# Altium project mainpcb.PrjPcb (part 1 of 2)
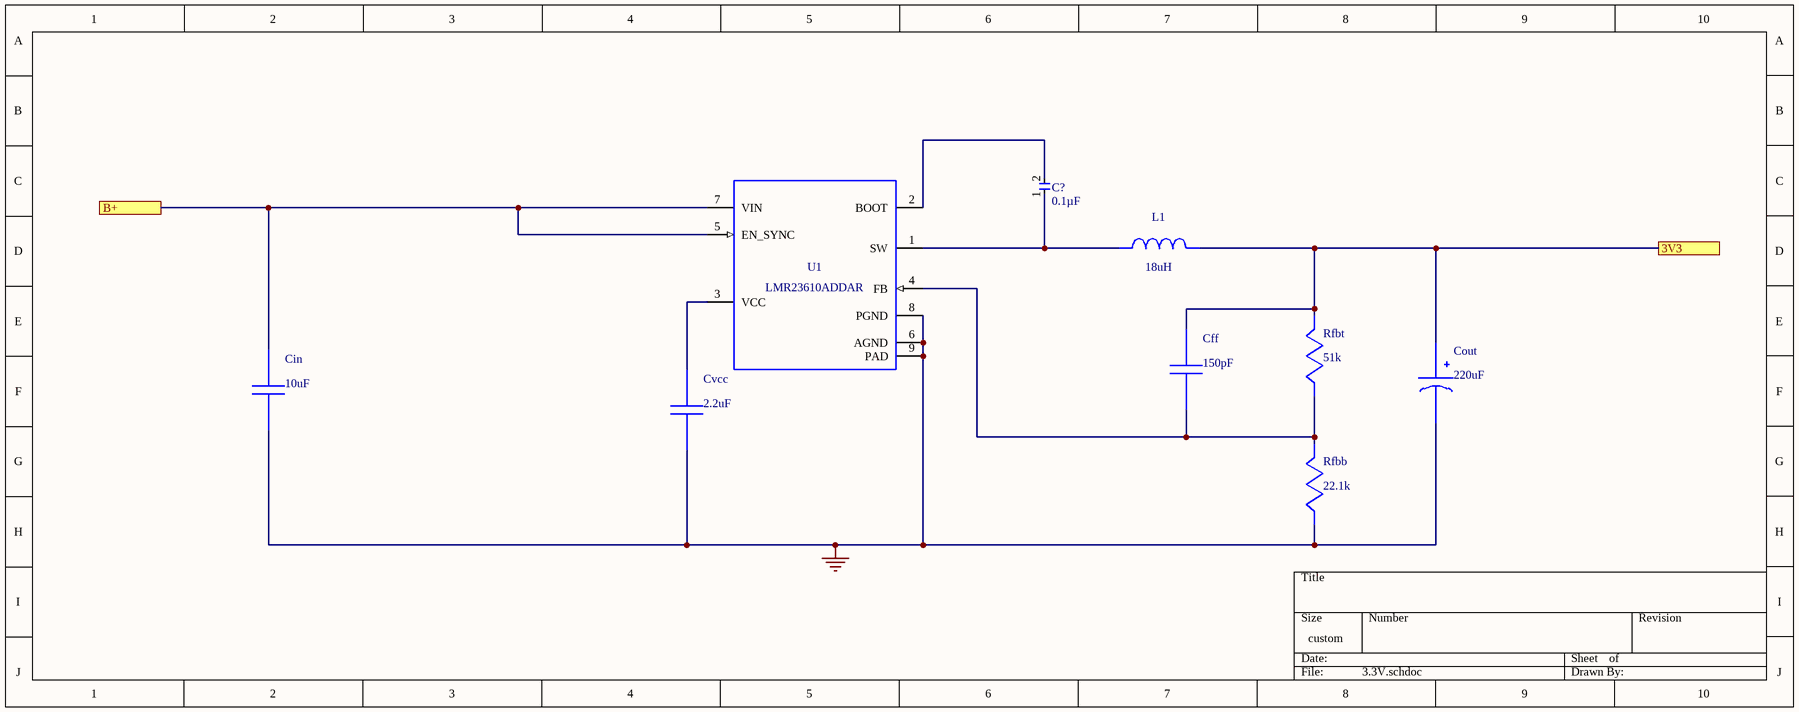
[diagram p0: 3.3V.schdoc]
5 sheets, 73 parts. Net scope: flat (ports and power ports of the same name join across sheets).
Sheets:
  3.3V.schdoc
  7.4V.schdoc
  BMS.SchDoc
  mainpcb.SchDoc
  Power sTM.SchDoc

## Sheet 3.3V.schdoc
size 336 x 132 mm; SheetNumber: 1; SheetTotal: 5

### Parts
(Parts that share a designator on the sheet are numbered #1, #2 ... from top to bottom, then left to right.)
C?#1  0.1µF
Cff  value 150pF  (hidden comment: 250R07N151JV4T)
Cin#1  value 10uF  (hidden comment: C3225X7R1H106M250AC)
Cout#1  value 220uF  (hidden comment: 6SVPE220MW)
Cvcc  value 2.2uF  (hidden comment: C0603C225K8PACTU)
L1#1  value 18uH  (hidden comment: NPI54C180MTRF)
Rfbb#1  value 22.1k  (hidden comment: CRCW040222K1FKED)
Rfbt#1  value 51k  (hidden comment: RC0603FR-0751KL)
U1#1  LMR23610ADDAR

### Ports
3V3, B+

### Nets
0: Cin#1.2 Cout#1.2(-) Cvcc.2 Rfbb#1.2 U1#1.6(AGND) U1#1.8(PGND) U1#1.9(PAD)
NetC?#1_1: C?#1.1 L1#1.1 U1#1.1(SW)
NetC?#1_2: C?#1.2 U1#1.2(BOOT)
NetCff_1: Cff.1 Cout#1.1(+) L1#1.2 Rfbt#1.1 ; port 3V3
NetCff_2: Cff.2 Rfbb#1.1 Rfbt#1.2 U1#1.4(FB)
NetCin#1_1: Cin#1.1 U1#1.5(EN_SYNC) U1#1.7(VIN) ; port B+
NetCvcc_1: Cvcc.1 U1#1.3(VCC)

### Library data of the parts
C?#1 = C0805C104K5RACTU: Cap Ceramic 0.1uF 50V X7R 10% SMD 2.0 x 1.2 mm 125 C Paper T/R; Manufacturer: KEMET; Capacitance: 100nF; Voltage: 500V; Supplier 1: Farnell; Manufacturer Part Number: C0805C104K5RACTU; RoHS: Yes; Category: Ceramic Capacitors; Stock 1: 148517; Pricing 1: 10=0,07810, 100=0,05810, 500=0,03910, 1000=0,03450, 2000=0,03090 (GBP); Mount: Surface Mount,PCB; Case/Package: 0805; Number of Pins: 2; Case Code (Imperial): 0805; Case Code (Metric): 2012; Contact Plating: Tin,Matte; Dielectric Material: Ceramic; Min Operating Temperature: -55°C; Max Operating Temperature: 125°C; Tolerance: 10%; Dielectric: X7R; Package Quantity: 4000; Voltage Rating: 50V; Packaging: Tape and Reel; Voltage Rating (DC): 50V; Termination: SMD/SMT; Series: C0805C; Construction: Flat; Length: 2mm; Width: 1.2mm; Height: 0.9mm; Depth: 1.25mm; Lead Pitch: 0.75mm; Thickness: 0.035inch; Radiation Hardening: No; RoHS Compliant: Yes; REACH SVHC: No SVHC; ComponentLink1URL: https://datasheet.ciiva.com/14589/70095383-14589048.pdf?src-supplier=Allied+Electronics; ComponentLink1Description: https://datasheet.ciiva.com/14589/70095383-14589048.pdf?src-supplier=Allied+Electronics; ComponentLink2URL: https://datasheet.ciiva.com/28682/1851736-28682232.pdf?src-supplier=Element14; ComponentLink2Description: https://datasheet.ciiva.com/28682/1851736-28682232.pdf?src-supplier=Element14; ComponentLink3URL: https://datasheet.ciiva.com/32431/slceramic-chip-condensers-e-32431755.pdf?src-supplier=Distrelec; ComponentLink3Description: https://datasheet.ciiva.com/32431/slceramic-chip-condensers-e-32431755.pdf?src-supplier=Distrelec; ComponentLink4URL: https://datasheet.ciiva.com/18410/70095383-18410815.pdf?src-supplier=Allied+Electronics; ComponentLink4Description: https://datasheet.ciiva.com/18410/70095383-18410815.pdf?src-supplier=Allied+Electronics; Supplier Part Number 1: 1414664
Cff = 250R07N151JV4T: Manufacturer Name: Johanson Technology; PackageReference: 250R07N151JV4T; Manufacturer Part Number: 250R07N151JV4T
Cin#1 = C3225X7R1H106M250AC: C3225X7R1H106M25; Manufacturer Name: TDK; PackageReference: C3225X7R1H106M250AC; Manufacturer Part Number: C3225X7R1H106M250AC
Cout#1 = 6SVPE220MW: Manufacturer Name: Panasonic; PackageReference: 6SVPE220MW; Manufacturer Part Number: 6SVPE220MW
Cvcc = C0603C225K8PACTU: Manufacturer Name: Kemet; PackageReference: C0603C225K8PACTU; Manufacturer Part Number: C0603C225K8PACTU
L1#1 = NPI54C180MTRF: Manufacturer Name: NIC Components; PackageReference: NPI54C180MTRF; Manufacturer Part Number: NPI54C180MTRF
Rfbb#1 = CRCW040222K1FKED: Manufacturer Name: Vishay-Dale; PackageReference: CRCW040222K1FKED; Manufacturer Part Number: CRCW040222K1FKED
Rfbt#1 = RC0603FR-0751KL: Manufacturer Name: Yageo; PackageReference: RC0603FR-0751KL; Manufacturer Part Number: RC0603FR-0751KL
U1#1 = LMR23610ADDAR: Manufacturer Name: Texas Instruments; PackageReference: LMR23610ADDAR; Manufacturer Part Number: LMR23610ADDAR; Value: N/A

## Sheet 7.4V.schdoc
size 349 x 134 mm; SheetNumber: 2; SheetTotal: 5
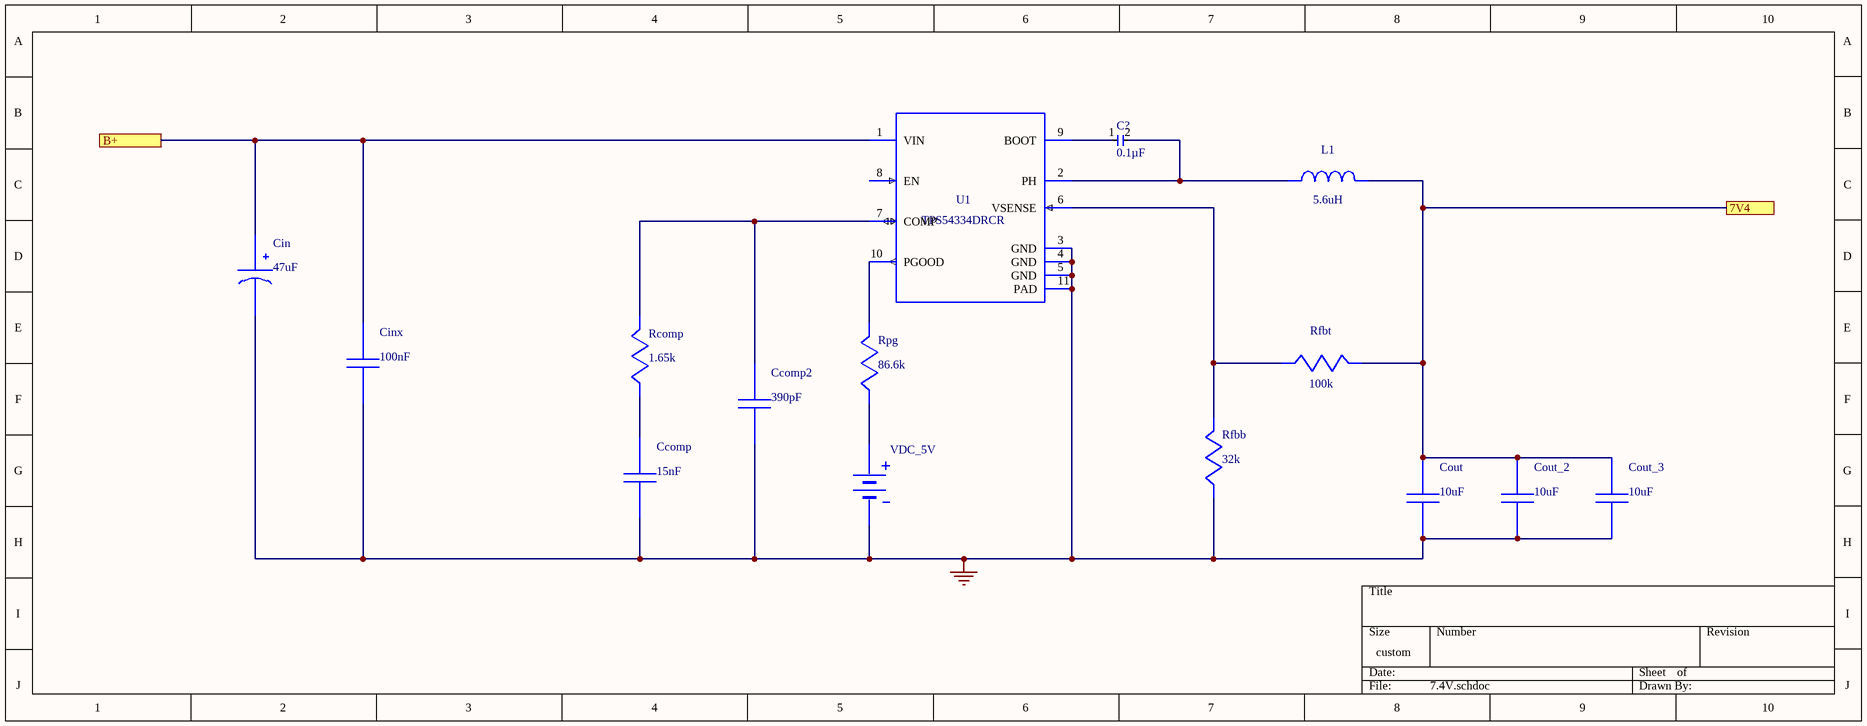
[diagram p1: 7.4V.schdoc]

### Parts
(Parts that share a designator on the sheet are numbered #1, #2 ... from top to bottom, then left to right.)
C?#2  0.1µF
Ccomp  value 15nF  (hidden comment: CGA4F2C0G1H153J085AA)
Ccomp2  value 390pF  (hidden comment: GRM1555C1H391JA01J)
Cin#2  value 47uF  (hidden comment: EEE-FC1H470P)
Cinx  value 100nF  (hidden comment: C0805C104M5RACTU)
Cout#2  value 10uF  (hidden comment: C0805C106K8PACTU)
Cout_2  value 10uF  (hidden comment: C0805C106K8PACTU)
Cout_3  value 10uF  (hidden comment: C0805C106K8PACTU)
L1#2  value 5.6uH  (hidden comment: NPI54C5R6MTRF)
Rcomp  value 1.65k  (hidden comment: CRCW04021K65FKED)
Rfbb#2  value 32k  (hidden comment: TNPW040232K0BEED)
Rfbt#2  value 100k  (hidden comment: CRCW0402100KFKED)
Rpg  value 86.6k  (hidden comment: RC0201FR-0786K6L)
U1#2  TPS54334DRCR
VDC_5V  WB_PRIM_DC_VOLTAGE_SOURCE  (value not drawn)

### Ports
7V4, B+

### Nets
0: Ccomp.2 Ccomp2.2 Cin#2.2(-) Cinx.2 Cout#2.2 Cout_2.2 Cout_3.2 Rfbb#2.1 U1#2.3(GND) U1#2.4(GND) U1#2.5(GND) U1#2.11(PAD) VDC_5V.2(-)
NetC?#2_1: C?#2.1 U1#2.9(BOOT)
NetC?#2_2: C?#2.2 L1#2.1 U1#2.2(PH)
NetCcomp2_1: Ccomp2.1 Rcomp.1 U1#2.7(COMP)
NetCcomp_1: Ccomp.1 Rcomp.2
NetCin#1_1: Cin#2.1(+) Cinx.1 U1#2.1(VIN) ; port B+
NetCout#2_1: Cout#2.1 Cout_2.1 Cout_3.1 L1#2.2 Rfbt#2.1 ; port 7V4
NetRfbb#2_2: Rfbb#2.2 Rfbt#2.2 U1#2.6(VSENSE)
NetRpg_1: Rpg.1 U1#2.10(PGOOD)
NetRpg_2: Rpg.2 VDC_5V.1(+)

Not connected (* = marked no-connect by the designer): U1#2 8(EN)

### Library data of the parts
C?#2 = C0805C104K5RACTU: as C?#1 on sheet 3.3V; Supplier 1: Farnell; Manufacturer Part Number: C0805C104K5RACTU; RoHS: Yes; Category: Ceramic Capacitors; Stock 1: 148517; Pricing 1: 10=0,07810, 100=0,05810, 500=0,03910, 1000=0,03450, 2000=0,03090 (GBP); Mount: Surface Mount,PCB; Case/Package: 0805; Number of Pins: 2; Case Code (Imperial): 0805; Case Code (Metric): 2012; Contact Plating: Tin,Matte; Dielectric Material: Ceramic; Min Operating Temperature: -55°C; Max Operating Temperature: 125°C; Tolerance: 10%; Dielectric: X7R; Package Quantity: 4000; Voltage Rating: 50V; Packaging: Tape and Reel; Voltage Rating (DC): 50V; Termination: SMD/SMT; Series: C0805C; Construction: Flat; Length: 2mm; Width: 1.2mm; Height: 0.9mm; Depth: 1.25mm; Lead Pitch: 0.75mm; Thickness: 0.035inch; Radiation Hardening: No; RoHS Compliant: Yes; REACH SVHC: No SVHC; ComponentLink1URL: https://datasheet.ciiva.com/14589/70095383-14589048.pdf?src-supplier=Allied+Electronics; ComponentLink1Description: https://datasheet.ciiva.com/14589/70095383-14589048.pdf?src-supplier=Allied+Electronics; ComponentLink2URL: https://datasheet.ciiva.com/28682/1851736-28682232.pdf?src-supplier=Element14; ComponentLink2Description: https://datasheet.ciiva.com/28682/1851736-28682232.pdf?src-supplier=Element14; ComponentLink3URL: https://datasheet.ciiva.com/32431/slceramic-chip-condensers-e-32431755.pdf?src-supplier=Distrelec; ComponentLink3Description: https://datasheet.ciiva.com/32431/slceramic-chip-condensers-e-32431755.pdf?src-supplier=Distrelec; ComponentLink4URL: https://datasheet.ciiva.com/18410/70095383-18410815.pdf?src-supplier=Allied+Electronics; ComponentLink4Description: https://datasheet.ciiva.com/18410/70095383-18410815.pdf?src-supplier=Allied+Electronics; Supplier Part Number 1: 1414664
Ccomp = CGA4F2C0G1H153J085AA: CGA4F2C0G1H153J0; Manufacturer Name: TDK; PackageReference: CGA4F2C0G1H153J085AA; Manufacturer Part Number: CGA4F2C0G1H153J085AA
Ccomp2 = GRM1555C1H391JA01J: GRM1555C1H391JA0; Manufacturer Name: MuRata; PackageReference: GRM1555C1H391JA01J; Manufacturer Part Number: GRM1555C1H391JA01J
Cin#2 = EEE-FC1H470P: Manufacturer Name: Panasonic; PackageReference: EEE-FC1H470P; Manufacturer Part Number: EEE-FC1H470P
Cinx = C0805C104M5RACTU: Manufacturer Name: Kemet; PackageReference: C0805C104M5RACTU; Manufacturer Part Number: C0805C104M5RACTU
Cout#2 Cout_2 Cout_3 = C0805C106K8PACTU: Manufacturer Name: Kemet; PackageReference: C0805C106K8PACTU; Manufacturer Part Number: C0805C106K8PACTU
L1#2 = NPI54C5R6MTRF: Manufacturer Name: NIC Components; PackageReference: NPI54C5R6MTRF; Manufacturer Part Number: NPI54C5R6MTRF
Rcomp = CRCW04021K65FKED: Manufacturer Name: Vishay-Dale; PackageReference: CRCW04021K65FKED; Manufacturer Part Number: CRCW04021K65FKED
Rfbb#2 = TNPW040232K0BEED: Manufacturer Name: Vishay-Dale; PackageReference: TNPW040232K0BEED; Manufacturer Part Number: TNPW040232K0BEED
Rfbt#2 = CRCW0402100KFKED: Manufacturer Name: Vishay-Dale; PackageReference: CRCW0402100KFKED; Manufacturer Part Number: CRCW0402100KFKED
Rpg = RC0201FR-0786K6L: Manufacturer Name: Yageo; PackageReference: RC0201FR-0786K6L; Manufacturer Part Number: RC0201FR-0786K6L
U1#2 = TPS54334DRCR: Manufacturer Name: Texas Instruments; PackageReference: TPS54334DRCR; Manufacturer Part Number: TPS54334DRCR; Value: N/A
VDC_5V = WB_PRIM_DC_VOLTAGE_SOURCE: WB_PRIM_DC_VOLTA; PackageReference: WB_PRIM_DC_VOLTAGE_SOURCE; Manufacturer Part Number: WB_PRIM_DC_VOLTAGE_SOURCE; Manufacturer Name: WB_PRIM_DC_VOLTAGE_SOURCE; Value: N/A

## Sheet BMS.SchDoc
size A4; SheetNumber: 3; SheetTotal: 5
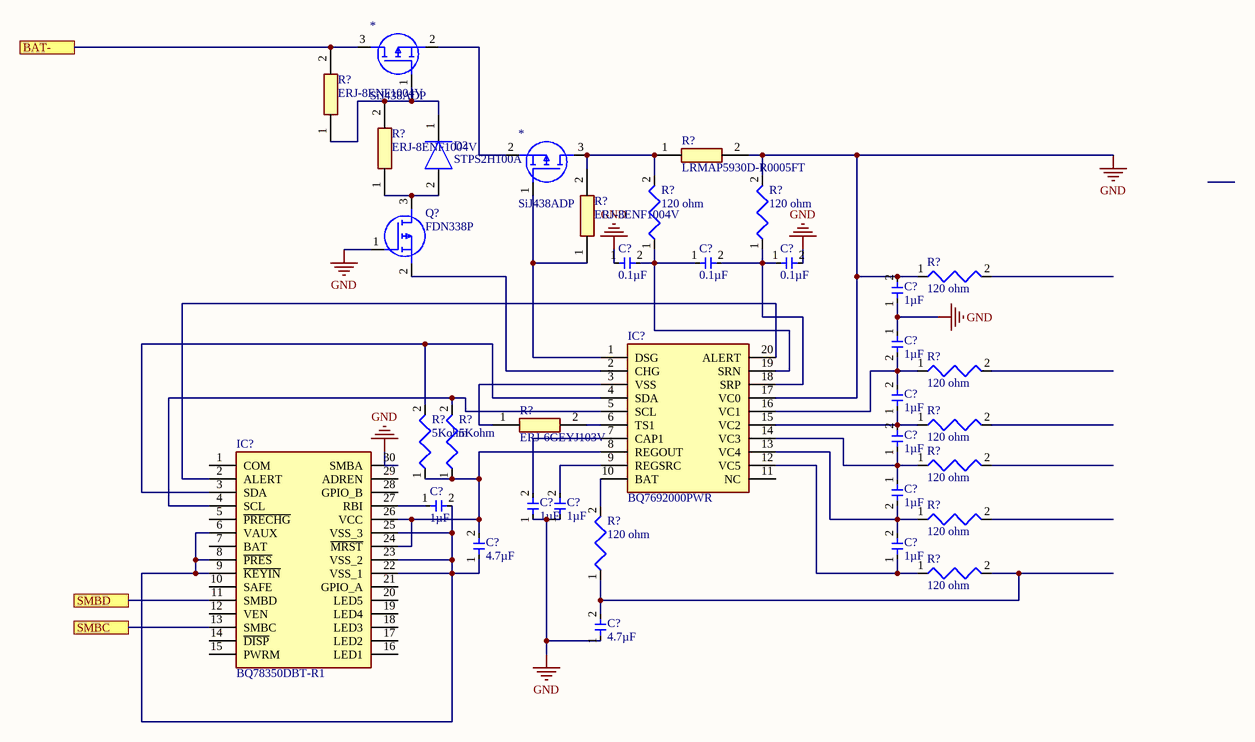
[diagram p2: BMS.SchDoc]

### Parts
(Parts that share a designator on the sheet are numbered #1, #2 ... from top to bottom, then left to right.)
*#1  SiJ438ADP
*#2  SiJ438ADP
C?#3  0.1µF  [0603]
C?#4  0.1µF  [0603]
C?#5  0.1µF  [0603]
C?#6  1µF  [0603]
C?#7  1µF  [0603]
C?#8  1µF  [0603]
C?#9  1µF  [0603]
C?#10  1µF  [0603]
C?#11  1µF  [0603]
C?#12  1µF  [0603]
C?#13  1µF  [0603]
C?#14  4.7µF  [0603]
C?#15  1µF  [0603]
C?#16  4.7µF  [0603]
D?  STPS2H100A  [DIOM5126X265N]
IC?#1  BQ7692000PWR  [SOP65P640X120-20N]
IC?#2  BQ78350DBT-R1  [SOP50P640X120-30N]
Q?#1  FDN338P  [SOT95P237X112-3N]
R?#1  ERJ-8ENF1004V  [RESC3116X70N]
R?#2  LRMAP5930D-R0005FT  [RESC15078X157N]
R?#3  ERJ-8ENF1004V  [RESC3116X70N]
R?#4  120 ohm  [CRCW0603]
R?#5  120 ohm  [CRCW0603]
R?#6  ERJ-8ENF1004V  [RESC3116X70N]
R?#7  120 ohm  [CRCW0603]
R?#8  120 ohm  [CRCW0603]
R?#9  ERJ-6GEYJ103V  [RESC2012X70N]
R?#10  120 ohm  [CRCW0603]
R?#11  5Kohm  [ERJ-2RK]
R?#12  5Kohm  [ERJ-2RK]
R?#13  120 ohm  [CRCW0603]
R?#14  120 ohm  [CRCW0603]
R?#15  120 ohm  [CRCW0603]
R?#16  120 ohm  [CRCW0603]

### Ports
BAT-, SMBC, SMBD

### Nets
GND: C?#3.1 C?#5.2 C?#6.1 C?#6.2 C?#7.1 C?#12.1 C?#13.1 C?#16.1 IC?#1.17(VC0) IC?#2.30(SMBA) Q?#1.1(G) R?#2.2 R?#5.2 R?#7.1
Net*#1_1: *#1.1(G) D?.1(K) R?#1.1 R?#3.2
Net*#1_2: *#1.2(S) *#2.2(S)
Net*#1_3: *#1.3(D) R?#1.2 ; port BAT-
Net*#2_1: *#2.1(G) IC?#1.1(DSG) R?#6.1
Net*#2_3: *#2.3(D) R?#2.1 R?#4.2 R?#6.2
NetC?#3_2: C?#3.2 C?#4.1 IC?#1.19(SRN) R?#4.1
NetC?#4_2: C?#4.2 C?#5.1 IC?#1.18(SRP) R?#5.1
NetC?#7_2: C?#7.2 C?#8.2 IC?#1.16(VC1) R?#8.1
NetC?#8_1: C?#8.1 C?#9.2 IC?#1.15(VC2) R?#10.1
NetC?#9_1: C?#9.1 C?#10.1 IC?#1.14(VC3) R?#13.1
NetC?#10_2: C?#10.2 C?#15.2 IC?#1.13(VC4) R?#14.1
NetC?#11_1: C?#11.1 IC?#2.27(RBI)
NetC?#11_2: C?#11.2 C?#14.1 IC?#2.6(VAUX) IC?#2.8(~{PRES}) IC?#2.9(~{KEYIN}) IC?#2.22(VSS_1) IC?#2.23(VSS_2) IC?#2.25(VSS_3)
NetC?#12_2: C?#12.2 IC?#1.7(CAP1)
NetC?#13_2: C?#13.2 IC?#1.9(REGSRC)
NetC?#14_2: C?#14.2 IC?#1.8(REGOUT) IC?#2.24(~{MRST}) IC?#2.26(VCC) R?#11.1 R?#12.1
NetC?#15_1: C?#15.1 IC?#1.12(VC5) R?#16.1
NetC?#16_2: C?#16.2 R?#15.1 R?#16.2
NetD?_2: D?.2(A) Q?#1.3(D) R?#3.1
NetIC?#1_2: IC?#1.2(CHG) Q?#1.2(S)
NetIC?#1_3: IC?#1.3(VSS) R?#9.1
NetIC?#1_4: IC?#1.4(SDA) IC?#2.3(SDA) R?#11.2
NetIC?#1_5: IC?#1.5(SCL) IC?#2.4(SCL) R?#12.2
NetIC?#1_6: IC?#1.6(TS1) R?#9.2
NetIC?#1_10: IC?#1.10(BAT) R?#15.2
NetIC?#1_20: IC?#1.20(ALERT) IC?#2.2(ALERT)
NetIC?#2_11: IC?#2.11(SMBD) ; port SMBD
NetIC?#2_13: IC?#2.13(SMBC) ; port SMBC

Not connected (* = marked no-connect by the designer): IC?#1 11(NC); IC?#2 1(COM) 5(~{PRECHG}) 7(BAT) 10(SAFE) 12(VEN) 14(~{DISP}) 15(PWRM) 16(LED1) 17(LED2) 18(LED3) 19(LED4) 20(LED5) 21(GPIO_A) 28(GPIO_B) 29(ADREN); R?#7 2; R?#8 2; R?#10 2; R?#13 2; R?#14 2

### Library data of the parts
C?#3-C?#5 = 0603YC104KAT2A: Cap Ceramic 0.1uF 16V X7R 10% SMD 0603 125C Paper T/R; Manufacturer: Kyocera AVX; Capacitance: 100nF; Insulation Resistance: 100GR; Dissipation Factor: 3.5%; Supplier 1: Farnell; Manufacturer Part Number: 0603YC104KAT2A; RoHS: Yes; Category: Ceramic Capacitors; Stock 1: 61599; Pricing 1: 10=0.06680, 100=0.05510, 500=0.03380, 1000=0.02430, 2000=0.02420, 4000=0.01760, 20000=0.01470 (EUR); Mount: Surface Mount,PCB; Case/Package: 0603; Number of Pins: 2; Case Code (Metric): 1608; Case Code (Imperial): 0603; Contact Plating: Tin,Matte; Min Operating Temperature: -55°C; Max Operating Temperature: 125°C; Tolerance: 10%; Dielectric: X7R; Packaging: Tape and Reel; Voltage Rating (DC): 16V; Voltage: 16V; Voltage Rating: 16V; Package Quantity: 1; Termination: SMD/SMT; Series: -; Construction: Flat; Length: 1.6mm; Width: 0.032inch; Height: 0.9mm; Depth: 0.81mm; Thickness: 0.035inch; Radiation Hardening: No; REACH SVHC: No SVHC; Lead Free: Lead Free; RoHS Compliant: Yes; ComponentLink1URL: https://datasheet.ciiva.com/11788/0900766b80dc2409-11788525.pdf?src-supplier=RSComponents; ComponentLink1Description: https://datasheet.ciiva.com/11788/0900766b80dc2409-11788525.pdf?src-supplier=RSComponents; ComponentLink2URL: https://datasheet.ciiva.com/1458/84526-1458128.pdf?src-supplier=Element14; ComponentLink2Description: https://datasheet.ciiva.com/1458/84526-1458128.pdf?src-supplier=Element14; ComponentLink3URL: https://datasheet.ciiva.com/1458/84526-1458129.pdf?src-supplier=Element14; ComponentLink3Description: https://datasheet.ciiva.com/1458/84526-1458129.pdf?src-supplier=Element14; ComponentLink4URL: https://datasheet.ciiva.com/150/cx7r-150230.pdf?src-supplier=Digi-Key; ComponentLink4Description: https://datasheet.ciiva.com/150/cx7r-150230.pdf?src-supplier=Digi-Key; ComponentLink5URL: https://datasheet.ciiva.com/28613/683218-28613286.pdf?src-supplier=Element14; ComponentLink5Description: https://datasheet.ciiva.com/28613/683218-28613286.pdf?src-supplier=Element14; ComponentLink6URL: https://datasheet.ciiva.com/150/cx7r-150231.pdf?src-supplier=Digi-Key; ComponentLink6Description: https://datasheet.ciiva.com/150/cx7r-150231.pdf?src-supplier=Digi-Key; ComponentLink7URL: https://datasheet.ciiva.com/150/cx7r-150232.pdf?src-supplier=Digi-Key; ComponentLink7Description: https://datasheet.ciiva.com/150/cx7r-150232.pdf?src-supplier=Digi-Key; ComponentLink8URL: https://datasheet.ciiva.com/5427/cx7r-218113-5427486.pdf?src-supplier=Mouser; ComponentLink8Description: https://datasheet.ciiva.com/5427/cx7r-218113-5427486.pdf?src-supplier=Mouser; ComponentLink9URL: https://datasheet.ciiva.com/14585/70001075-14585102.pdf?src-supplier=Allied+Electronics; ComponentLink9Description: https://datasheet.ciiva.com/14585/70001075-14585102.pdf?src-supplier=Allied+Electronics; ComponentLink10URL: https://datasheet.ciiva.com/11464/cx7r-11464543.pdf?src-supplier=Avnet; ComponentLink10Description: https://datasheet.ciiva.com/11464/cx7r-11464543.pdf?src-supplier=Avnet; Supplier Part Number 1: 1327679
C?#6-C?#13 C?#15 = 0603YD105KAT2A: AVX - 0603YD105KAT2A - SMD Multilayer Ceramic Capacitor, 1 µF, 16 V, 0603 [1608 Metric], ± 10%, X5R, AVX 0603 MLCC; Manufacturer: Kyocera AVX; Capacitance: 1uF; Voltage Rating: 16V; Dissipation Factor: 12.5%; Insulation Resistance: 10GR; Supplier 1: Farnell; Manufacturer Part Number: 0603YD105KAT2A; RoHS: Yes; Category: Ceramic Capacitors; Stock 1: 33961; Pricing 1: 10=0.07550, 100=0.05170, 500=0.03710, 1000=0.03000, 2000=0.02970, 4000=0.02940, 20000=0.02000 (EUR); Mount: Surface Mount; Case/Package: 0603; Number of Pins: 2; Case Code (Metric): 1608; Case Code (Imperial): 0603; Min Operating Temperature: -55°C; Max Operating Temperature: 85°C; Tolerance: 10%; Dielectric: X5R; Voltage Rating (DC): 16V; Packaging: Tape and Reel; Voltage: 16V; Package Quantity: 1; Termination: SMD/SMT; Series: -; Construction: Flat; Length: 1.6mm; Width: 0.81mm; Height: 0.9mm; Depth: 0.81mm; Thickness: 0.035inch; Radiation Hardening: No; REACH SVHC: No SVHC; Lead Free: Lead Free; RoHS Compliant: Yes; ComponentLink1URL: https://datasheet.ciiva.com/11788/0900766b80def1a5-11788563.pdf?src-supplier=RSComponents; ComponentLink1Description: https://datasheet.ciiva.com/11788/0900766b80def1a5-11788563.pdf?src-supplier=RSComponents; ComponentLink2URL: https://datasheet.ciiva.com/34303/2012654-34303835.pdf?src-supplier=Jameco; ComponentLink2Description: https://datasheet.ciiva.com/34303/2012654-34303835.pdf?src-supplier=Jameco; ComponentLink3URL: https://datasheet.ciiva.com/2987/cx5r-2987890.pdf?src-supplier=Avnet; ComponentLink3Description: https://datasheet.ciiva.com/2987/cx5r-2987890.pdf?src-supplier=Avnet; ComponentLink4URL: https://datasheet.ciiva.com/5412/cx5r-5412550.pdf?src-supplier=Mouser; ComponentLink4Description: https://datasheet.ciiva.com/5412/cx5r-5412550.pdf?src-supplier=Mouser; ComponentLink5URL: https://datasheet.ciiva.com/150/cx5r-150392.pdf?src-supplier=Digi-Key; ComponentLink5Description: https://datasheet.ciiva.com/150/cx5r-150392.pdf?src-supplier=Digi-Key; ComponentLink6URL: https://datasheet.ciiva.com/14590/70001028-14590632.pdf?src-supplier=Allied+Electronics; ComponentLink6Description: https://datasheet.ciiva.com/14590/70001028-14590632.pdf?src-supplier=Allied+Electronics; ComponentLink7URL: https://datasheet.ciiva.com/150/cx5r-150393.pdf?src-supplier=Digi-Key; ComponentLink7Description: https://datasheet.ciiva.com/150/cx5r-150393.pdf?src-supplier=Digi-Key; ComponentLink8URL: https://datasheet.ciiva.com/1458/84508-1458137.pdf?src-supplier=Element14; ComponentLink8Description: https://datasheet.ciiva.com/1458/84508-1458137.pdf?src-supplier=Element14; ComponentLink9URL: https://datasheet.ciiva.com/150/cx5r-150394.pdf?src-supplier=Digi-Key; ComponentLink9Description: https://datasheet.ciiva.com/150/cx5r-150394.pdf?src-supplier=Digi-Key; ComponentLink10URL: https://datasheet.ciiva.com/1458/84508-1458138.pdf?src-supplier=Element14; ComponentLink10Description: https://datasheet.ciiva.com/1458/84508-1458138.pdf?src-supplier=Element14; ComponentLink11URL: https://datasheet.ciiva.com/14586/70001028-14586715.pdf?src-supplier=Allied+Electronics; ComponentLink11Description: https://datasheet.ciiva.com/14586/70001028-14586715.pdf?src-supplier=Allied+Electronics; Supplier Part Number 1: 1327680
C?#14 C?#16 = 0603ZD475KAT2A: AVX - 0603ZD475KAT2A - SMD Multilayer Ceramic Capacitor, 4.7 µF, 10 V, 0603 [1608 Metric], ± 10%, X5R, AVX 0603 MLCC; Manufacturer: Kyocera AVX; Capacitance: 4.7uF; Voltage Rating: 10V; Dissipation Factor: 3.5%; Supplier 1: Farnell; Manufacturer Part Number: 0603ZD475KAT2A; RoHS: Yes; Category: Ceramic Capacitors; Stock 1: 14307; Pricing 1: 10=0.39800, 100=0.22700, 500=0.14700, 1000=0.11700, 2000=0.09810, 4000=0.08400, 20000=0.05250 (EUR); Mount: Surface Mount; Case/Package: 0603; Number of Pins: 2; Case Code (Imperial): 0603; Case Code (Metric): 1608; Contact Plating: Tin,Matte; Min Operating Temperature: -55°C; Max Operating Temperature: 85°C; Tolerance: 10%; Dielectric: X5R; Package Quantity: 1; Voltage Rating (DC): 10V; Packaging: Tape and Reel; Termination: SMD/SMT; Series: -; Voltage: 10V; Construction: Flat; Length: 1.6mm; Width: 0.81mm; Height: 0.9mm; Depth: 0.81mm; Thickness: 0.035inch; Radiation Hardening: No; REACH SVHC: No SVHC; Lead Free: Lead Free; RoHS Compliant: Yes; ComponentLink1URL: https://datasheet.ciiva.com/1458/1796776-1458211.pdf?src-supplier=Element14; ComponentLink1Description: https://datasheet.ciiva.com/1458/1796776-1458211.pdf?src-supplier=Element14; ComponentLink2URL: https://datasheet.ciiva.com/15212/getdatasheetpartid-179504-15212405.pdf?src-supplier=Verical; ComponentLink2Description: https://datasheet.ciiva.com/15212/getdatasheetpartid-179504-15212405.pdf?src-supplier=Verical; ComponentLink3URL: https://datasheet.ciiva.com/11570/cx5r-11570838.pdf?src-supplier=Avnet; ComponentLink3Description: https://datasheet.ciiva.com/11570/cx5r-11570838.pdf?src-supplier=Avnet; ComponentLink4URL: https://datasheet.ciiva.com/6269/cx5r-6269191.pdf?src-supplier=Digi-Key; ComponentLink4Description: https://datasheet.ciiva.com/6269/cx5r-6269191.pdf?src-supplier=Digi-Key; ComponentLink5URL: https://datasheet.ciiva.com/14905/cx5r-14905225.pdf?src-supplier=Digi-Key; ComponentLink5Description: https://datasheet.ciiva.com/14905/cx5r-14905225.pdf?src-supplier=Digi-Key; ComponentLink6URL: https://datasheet.ciiva.com/7855/1666675-7855114.pdf?src-supplier=Element14; ComponentLink6Description: https://datasheet.ciiva.com/7855/1666675-7855114.pdf?src-supplier=Element14; ComponentLink7URL: https://datasheet.ciiva.com/14905/cx5r-14905226.pdf?src-supplier=Digi-Key; ComponentLink7Description: https://datasheet.ciiva.com/14905/cx5r-14905226.pdf?src-supplier=Digi-Key; ComponentLink8URL: https://datasheet.ciiva.com/7614/cx5r-7614716.pdf?src-supplier=Digi-Key; ComponentLink8Description: https://datasheet.ciiva.com/7614/cx5r-7614716.pdf?src-supplier=Digi-Key; ComponentLink9URL: https://datasheet.ciiva.com/28611/1598274-28611548.pdf?src-supplier=Element14; ComponentLink9Description: https://datasheet.ciiva.com/28611/1598274-28611548.pdf?src-supplier=Element14; ComponentLink10URL: https://datasheet.ciiva.com/22700/1796776-22700575.pdf?src-supplier=Element14; ComponentLink10Description: https://datasheet.ciiva.com/22700/1796776-22700575.pdf?src-supplier=Element14; Supplier Part Number 1: 1833806
D? = STPS2H100A: Diode; Manufacturer_Name: STMicroelectronics; Datasheet Link: https://componentsearchengine.com//STPS2H100A.pdf; Height: 2.65mm; Mouser2 Part Number: 511-STPS2H100A; Mouser2 Price/Stock: https://www.mouser.com/Search/Refine.aspx?Keyword=511-STPS2H100A; Manufacturer_Part_Number: STPS2H100A
IC?#1 = BQ7692000PWR: Integrated Circuit; Manufacturer_Name: Texas Instruments; Datasheet Link: http://www.ti.com/lit/gpn/bq76920; Height: 1.2mm; Manufacturer_Part_Number: BQ7692000PWR; Mouser Part Number: 595-BQ7692000PWR; Mouser Price/Stock: https://www.mouser.co.uk/ProductDetail/Texas-Instruments/BQ7692000PWR?qs=%2Fd%252BFzHvH4c0MjFeRoItEJg%3D%3D; Arrow Part Number: BQ7692000PWR; Arrow Price/Stock: https://www.arrow.com/en/products/bq7692000pwr/texas-instruments
IC?#2 = BQ78350DBT-R1: Integrated Circuit; Manufacturer_Name: Texas Instruments; Datasheet Link: http://www.ti.com/lit/ds/symlink/bq78350-r1.pdf; Height: 1.2mm; Manufacturer_Part_Number: BQ78350DBT-R1; Mouser Part Number: 595-BQ78350DBT-R1; Mouser Price/Stock: https://www.mouser.co.uk/ProductDetail/Texas-Instruments/BQ78350DBT-R1?qs=yajEpaT76uQsatHsVfjOmw%3D%3D; Arrow Part Number: BQ78350DBT-R1; Arrow Price/Stock: https://www.arrow.com/en/products/bq78350dbt-r1/texas-instruments
Q?#1 = FDN338P: MOSFET (P-Channel); Manufacturer_Name: ON Semiconductor; Height: 1.12mm; Manufacturer_Part_Number: FDN338P
R?#1 R?#3 R?#6 = ERJ-8ENF1004V: Resistor; Manufacturer_Name: Panasonic; Datasheet Link: https://industrial.panasonic.com/cdbs/www-data/pdf/RDA0000/AOA0000C86.pdf; Height: 0.7mm; Manufacturer_Part_Number: ERJ-8ENF1004V
R?#2 = LRMAP5930D-R0005FT: Resistor; Manufacturer_Name: TT ELECTRONICS / WELWYN; Datasheet Link: https://componentsearchengine.com/Datasheets/2/LRMAP5930D-R0005FT.pdf; Height: 1.57mm; Manufacturer_Part_Number: LRMAP5930D-R0005FT
R?#4 R?#5 R?#7 R?#8 R?#10 R?#13-R?#16 = CRCW0603120RFKEA: Res Thick Film 0603 120 Ohm 1% 1/10W ±100ppm/°C Molded SMD Paper T/R; Manufacturer: Vishay; Resistance: 120R; Max Power Dissipation: 100mW; Voltage Rating: 75V; Supplier 1: Farnell; Manufacturer Part Number: CRCW0603120RFKEA; RoHS: Yes; Category: Chip SMD Resistors; Stock 1: 98285; Pricing 1: 10=0.02730, 100=0.01530, 500=0.01020, 1000=0.00500, 2500=0.00450, 5000=0.00390, 25000=0.00330 (EUR); Mount: Surface Mount; Case/Package: 0603; Case Code (Metric): 1608; Case Code (Imperial): 0603; Contact Plating: Tin; Weight: 7.1E-05oz; Min Operating Temperature: -55°C; Max Operating Temperature: 155°C; Tolerance: 1%; Resistor Type: Thick Film; Temperature Coefficient: 100ppm/°C; Packaging: Tape and Reel; Number of Terminations: 2; Package Quantity: 10; Power Rating: 100mW; Termination: SMD/SMT; Features: Automotive AEC-Q200; Series: CRCW; Technology: THICK FILM; Construction: Rectangular; Resistance Tolerance: 1%; Voltage Rating (DC): 75V; Working Voltage: 75V; Length: 1.55mm; Width: 0.033inch; Height: 0.45mm; Depth: 0.85mm; Radiation Hardening: No; RoHS Compliant: Yes; REACH SVHC: Unknown; Military Standard: Not; Lead Free: Lead Free; ComponentLink1URL: https://datasheet.ciiva.com/11811/0900766b80d98afc-11811523.pdf?src-supplier=RSComponents; ComponentLink1Description: https://datasheet.ciiva.com/11811/0900766b80d98afc-11811523.pdf?src-supplier=RSComponents; ComponentLink2URL: https://datasheet.ciiva.com/2513/dcrcwe3-2513575.pdf?src-supplier=Digi-Key; ComponentLink2Description: https://datasheet.ciiva.com/2513/dcrcwe3-2513575.pdf?src-supplier=Digi-Key; ComponentLink3URL: https://datasheet.ciiva.com/2513/dcrcwe3-2513576.pdf?src-supplier=Digi-Key; ComponentLink3Description: https://datasheet.ciiva.com/2513/dcrcwe3-2513576.pdf?src-supplier=Digi-Key; ComponentLink4URL: https://datasheet.ciiva.com/26316/fld-crcw-e3-data-en-26316568.pdf?src-supplier=Distrelec; ComponentLink4Description: https://datasheet.ciiva.com/26316/fld-crcw-e3-data-en-26316568.pdf?src-supplier=Distrelec; ComponentLink5URL: https://datasheet.ciiva.com/2513/dcrcwe3-2513577.pdf?src-supplier=Digi-Key; ComponentLink5Description: https://datasheet.ciiva.com/2513/dcrcwe3-2513577.pdf?src-supplier=Digi-Key; ComponentLink6URL: https://datasheet.ciiva.com/5544/dcrcwe3-109170-5544139.pdf?src-supplier=Mouser; ComponentLink6Description: https://datasheet.ciiva.com/5544/dcrcwe3-109170-5544139.pdf?src-supplier=Mouser; ComponentLink7URL: https://datasheet.ciiva.com/7777/1533075-7777275.pdf?src-supplier=Element14; ComponentLink7Description: https://datasheet.ciiva.com/7777/1533075-7777275.pdf?src-supplier=Element14; ComponentLink8URL: https://datasheet.ciiva.com/7777/1697337-7777276.pdf?src-supplier=Element14; ComponentLink8Description: https://datasheet.ciiva.com/7777/1697337-7777276.pdf?src-supplier=Element14; ComponentLink9URL: https://datasheet.ciiva.com/16725/70201119-16725181.pdf?src-supplier=Allied+Electronics; ComponentLink9Description: https://datasheet.ciiva.com/16725/70201119-16725181.pdf?src-supplier=Allied+Electronics; Supplier Part Number 1: 1652832
R?#9 = ERJ-6GEYJ103V: Resistor; Manufacturer_Name: Panasonic; Height: 0.7mm; Manufacturer_Part_Number: ERJ-6GEYJ103V
R?#11 R?#12 = ERJ-2RKF4991X: Res Thick Film 0402 4.99K Ohm 1% 1/10W +/-100ppm/ßC Molded SMD Punched Carrier T/R; Manufacturer: Panasonic; Resistance: 4.99kR; Power Rating: 100mW; Voltage Rating: 50V; Temperature Coefficient: 100ppm/°C; Supplier 1: Farnell; Manufacturer Part Number: ERJ-2RKF4991X; RoHS: Yes; Category: Chip SMD Resistors; Stock 1: 164767; Pricing 1: 10=0.01960, 100=0.00930, 500=0.00630, 2500=0.00570, 5000=0.00530, 10000=0.00490, 50000=0.00440 (EUR); Mount: Surface Mount; Case/Package: 0402; Case Code (Metric): 1005; Case Code (Imperial): 0402; Weight: 2.8E-05oz; Contact Plating: Tin; Min Operating Temperature: -55°C; Max Operating Temperature: 155°C; Tolerance: 1%; Packaging: Tape and Reel; Package Quantity: 1; Resistor Type: Thick Film; Number of Terminations: 2; Termination: SMD/SMT; Max Power Dissipation: 100mW; Voltage Rating (DC): 50V; Working Voltage: 50V; Features: Automotive AEC-Q200; Series: ERJ; Resistance Tolerance: 1%; Technology: THICK FILM; Construction: Rectangular; Length: 1mm; Width: 0.02inch; Height: 0.016inch; Depth: 0.5mm; Radiation Hardening: No; REACH SVHC: No SVHC; Military Standard: Not; Lead Free: Lead Free; RoHS Compliant: Yes; ComponentLink1URL: https://datasheet.ciiva.com/16773/70260748-16773110.pdf?src-supplier=Allied+Electronics; ComponentLink1Description: https://datasheet.ciiva.com/16773/70260748-16773110.pdf?src-supplier=Allied+Electronics; ComponentLink2URL: https://datasheet.ciiva.com/22749/1678782-22749654.pdf?src-supplier=Element14; ComponentLink2Description: https://datasheet.ciiva.com/22749/1678782-22749654.pdf?src-supplier=Element14; ComponentLink3URL: https://datasheet.ciiva.com/24158/aoa0000ce2-24158871.pdf?src-supplier=Mouser; ComponentLink3Description: https://datasheet.ciiva.com/24158/aoa0000ce2-24158871.pdf?src-supplier=Mouser; ComponentLink4URL: https://datasheet.ciiva.com/46388/426256-46388311.pdf?src-supplier=Element14; ComponentLink4Description: https://datasheet.ciiva.com/46388/426256-46388311.pdf?src-supplier=Element14; ComponentLink5URL: https://datasheet.ciiva.com/16199/aoa0000ce2-16199546.pdf?src-supplier=Future+Electronics; ComponentLink5Description: https://datasheet.ciiva.com/16199/aoa0000ce2-16199546.pdf?src-supplier=Future+Electronics; ComponentLink6URL: https://datasheet.ciiva.com/16775/70260748-16775018.pdf?src-supplier=Allied+Electronics; ComponentLink6Description: https://datasheet.ciiva.com/16775/70260748-16775018.pdf?src-supplier=Allied+Electronics; ComponentLink7URL: https://datasheet.ciiva.com/46376/426256-46376955.pdf?src-supplier=Element14; ComponentLink7Description: https://datasheet.ciiva.com/46376/426256-46376955.pdf?src-supplier=Element14; ComponentLink8URL: https://datasheet.ciiva.com/48530/aoa0000ce2-48530971.pdf?src-supplier=Avnet; ComponentLink8Description: https://datasheet.ciiva.com/48530/aoa0000ce2-48530971.pdf?src-supplier=Avnet; Supplier Part Number 1: 2059145

## Sheet mainpcb.SchDoc
size A4; SheetNumber: 4; SheetTotal: 5
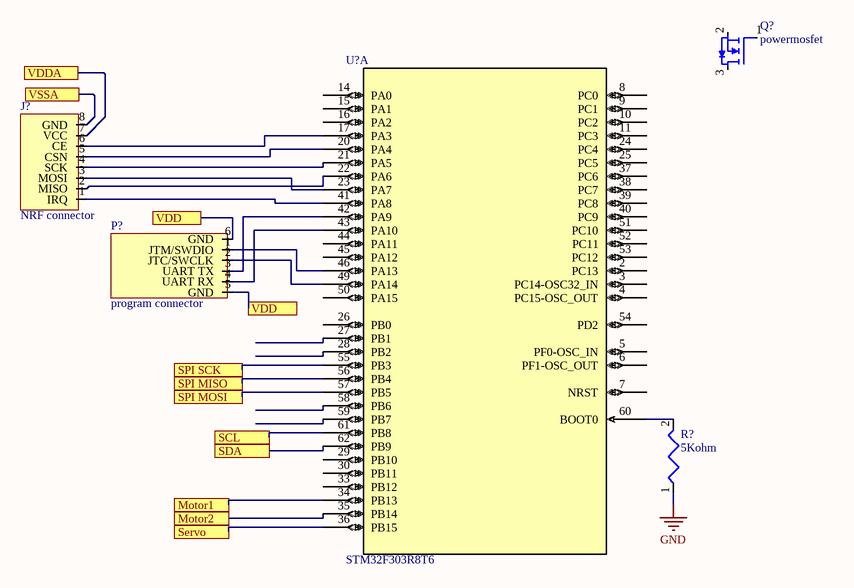
[diagram p3: mainpcb.SchDoc]

### Parts
(Parts that share a designator on the sheet are numbered #1, #2 ... from top to bottom, then left to right.)
J?  NRF connector  [8 pin RF]
P?  program connector  [M20-9980345]
Q?#2  powermosfet  [SI2336DS-T1-GE3 - duplicate]
R?#17  5Kohm  [ERJ-2RK]
U?#1  STM32F303R8T6  [LQFP64-10x10mm]  (part A of 2)

### Ports
Motor1, Motor2, SCL, SDA, Servo, SPI MISO, SPI MOSI, SPI SCK, VDD, VDDA, VSSA

### Nets
GND: R?#17.1
NetC?#17_2: P?.5(GND) P?.6(GND) ; port VDD
NetC?#22_1: J?.8(GND) ; port VSSA
NetC?#22_2: J?.7(VCC) ; port VDDA
NetJ?_1: J?.1(IRQ) U?#1.41(PA8)
NetJ?_2: J?.2(MISO) U?#1.22(PA6)
NetJ?_3: J?.3(MOSI) U?#1.23(PA7)
NetJ?_4: J?.4(SCK) U?#1.21(PA5)
NetJ?_5: J?.5(CSN) U?#1.20(PA4)
NetJ?_6: J?.6(CE) U?#1.17(PA3)
NetP?_1: P?.1(JTM/SWDIO) U?#1.46(PA13)
NetP?_2: P?.2(JTC/SWCLK) U?#1.49(PA14)
NetP?_3: P?.3(UART_TX) U?#1.42(PA9)
NetP?_4: P?.4(UART_RX) U?#1.43(PA10)
NetR?#17_2: R?#17.2 U?#1.60(BOOT0)
NetU?#1_34: U?#1.34(PB13) ; port Motor1
NetU?#1_35: U?#1.35(PB14) ; port Motor2
NetU?#1_36: U?#1.36(PB15) ; port Servo
NetU?#1_55: U?#1.55(PB3) ; port SPI SCK
NetU?#1_56: U?#1.56(PB4) ; port SPI MISO
NetU?#1_57: U?#1.57(PB5) ; port SPI MOSI
NetU?#1_61: U?#1.61(PB8) ; port SCL
NetU?#1_62: U?#1.62(PB9) ; port SDA

Not connected (* = marked no-connect by the designer): Q?#2 1(G) 2(S) 3(D); U?#1 2(PC13) 3(PC14-OSC32_IN) 4(PC15-OSC_OUT) 5(PF0-OSC_IN) 6(PF1-OSC_OUT) 7(NRST) 8(PC0) 9(PC1) 10(PC2) 11(PC3) 14(PA0) 15(PA1) 16(PA2) 24(PC4) 25(PC5) 26(PB0) 27(PB1) 28(PB2) 29(PB10) 30(PB11) 33(PB12) 37(PC6) 38(PC7) 39(PC8) 40(PC9) 44(PA11) 45(PA12) 50(PA15) 51(PC10) 52(PC11) 53(PC12) 54(PD2) 58(PB6) 59(PB7)

### Library data of the parts
J? = 8 pin NRF
P? = M20-9980345: HARWIN - M20-9980345 - Board-To-Board Connector, Vertical, 2.54 mm, 6 Contacts, Header, M20 Series, Through Hole, 2 Rows; Number of Contacts: 6; Max Current Rating: 3A; Contact Resistance: 25mR; Gender: Male; Insulation Resistance: 10GR; Connector Type: Male Pin; Pitch: 2.54mm; Row Spacing: 0.1inch; Supplier 1: Digi-Key; Manufacturer: Harwin; Manufacturer Part Number: M20-9980345; RoHS: Yes; Category: Headers and Wire Housings; Stock 1: 24477; Pricing 1: 1=0.29000, 10=0.27300, 100=0.19110, 500=0.16380, 1000=0.13650, 5000=0.11700, 10000=0.10920 (USD); Mount: Through Hole; Contact Plating: Gold; Contact Material: Brass,Bronze; Color: Black; Weight: 0.125lb; Housing Color: Black; Housing Material: Nylon; Insulation Material: Polyester; Min Operating Temperature: -40°C; Max Operating Temperature: 105°C; Number of Rows: 2; Termination: Solder; Package Quantity: 1000; Current Rating: 3A; Packaging: Bag; Number of Positions: 6; Orientation: Straight; Series: M20; Contact Type: Male Pin; Length: 7.62mm; Width: 0.25inch; Height: 0.125inch; Contact Mating Length: 0.24inch; Depth: 5.08mm; Radiation Hardening: No; REACH SVHC: No SVHC; RoHS Compliant: Yes; ComponentLink1URL: https://datasheet.ciiva.com/6789/91635-6789923.pdf?src-supplier=Newark; ComponentLink1Description: https://datasheet.ciiva.com/6789/91635-6789923.pdf?src-supplier=Newark; ComponentLink2URL: https://datasheet.ciiva.com/11746/0900766b80da602b-11746662.pdf?src-supplier=RSComponents; ComponentLink2Description: https://datasheet.ciiva.com/11746/0900766b80da602b-11746662.pdf?src-supplier=RSComponents; ComponentLink3URL: https://datasheet.ciiva.com/26852/getdatasheetpartid-420465-26852189.pdf?src-supplier=Verical; ComponentLink3Description: https://datasheet.ciiva.com/26852/getdatasheetpartid-420465-26852189.pdf?src-supplier=Verical; ComponentLink4URL: https://datasheet.ciiva.com/6830/m20-998-6830775.pdf?src-supplier=Digi-Key; ComponentLink4Description: https://datasheet.ciiva.com/6830/m20-998-6830775.pdf?src-supplier=Digi-Key; ComponentLink5URL: https://datasheet.ciiva.com/8046/112195-8046904.pdf?src-supplier=Element14; ComponentLink5Description: https://datasheet.ciiva.com/8046/112195-8046904.pdf?src-supplier=Element14; Supplier Part Number 1: 952-2120-ND
Q?#2 = SI2336DS-T1-GE3: MOSFET N-CH 30V 5.2A SOT-23; Manufacturer: Vishay Siliconix; Rds On Max: 42mR; Input Capacitance: 560pF; Gate to Source Voltage (Vgs): 8V; Element Configuration: Single; Max Power Dissipation: 1.8W; Number of Elements: 1; Power Dissipation: 1.25W; Rise Time: 10ns; Nominal Vgs: 400mV; Turn-Off Delay Time: 20ns; Turn-On Delay Time: 6ns; Polarity: N-CHANNEL; Supplier 1: Farnell; Manufacturer Part Number: SI2336DS-T1-GE3; RoHS: Yes; Category: MOSFETs; Stock 1: 10813; Pricing 1: 1=0.51400, 10=0.35200, 100=0.26600, 500=0.21000, 1000=0.18300, 5000=0.15400 (EUR); Mount: Surface Mount; Case/Package: SOT-23; Number of Pins: 3; Weight: 0.050717oz; Min Operating Temperature: -55°C; Max Operating Temperature: 150°C; Packaging: Tape and Reel; Package Quantity: 1; Continuous Drain Current (ID): 5.2A; Drain to Source Voltage (Vdss): 30V; Drain to Source Resistance: 42mR; Fall Time: 10ns; Threshold Voltage: 400mV; Number of Channels: 1; Series: TrenchFET®; REACH SVHC: No SVHC; Lead Free: Lead Free; RoHS Compliant: Yes; ComponentLink1URL: https://datasheet.ciiva.com/11160/si2336ds-11160912.pdf?src-supplier=Avnet; ComponentLink1Description: https://datasheet.ciiva.com/11160/si2336ds-11160912.pdf?src-supplier=Avnet; ComponentLink2URL: https://datasheet.ciiva.com/4440/si2336ds-260499-4440346.pdf?src-supplier=Mouser; ComponentLink2Description: https://datasheet.ciiva.com/4440/si2336ds-260499-4440346.pdf?src-supplier=Mouser; ComponentLink3URL: https://datasheet.ciiva.com/22697/1915678-22697818.pdf?src-supplier=Element14; ComponentLink3Description: https://datasheet.ciiva.com/22697/1915678-22697818.pdf?src-supplier=Element14; ComponentLink4URL: https://datasheet.ciiva.com/6373/si2336ds-6373839.pdf?src-supplier=Digi-Key; ComponentLink4Description: https://datasheet.ciiva.com/6373/si2336ds-6373839.pdf?src-supplier=Digi-Key; ComponentLink5URL: https://datasheet.ciiva.com/7788/si2336ds-7788767.pdf?src-supplier=Element14; ComponentLink5Description: https://datasheet.ciiva.com/7788/si2336ds-7788767.pdf?src-supplier=Element14; ComponentLink6URL: https://datasheet.ciiva.com/6373/si2336ds-6373836.pdf?src-supplier=Digi-Key; ComponentLink6Description: https://datasheet.ciiva.com/6373/si2336ds-6373836.pdf?src-supplier=Digi-Key; ComponentLink7URL: https://datasheet.ciiva.com/6376/si2336ds-6376271.pdf?src-supplier=Digi-Key; ComponentLink7Description: https://datasheet.ciiva.com/6376/si2336ds-6376271.pdf?src-supplier=Digi-Key; Supplier Part Number 1: 1858945
R?#17 = ERJ-2RKF4991X: as R?#11 on sheet BMS; Supplier 1: Farnell; Manufacturer Part Number: ERJ-2RKF4991X; RoHS: Yes; Category: Chip SMD Resistors; Stock 1: 164767; Pricing 1: 10=0.01960, 100=0.00930, 500=0.00630, 2500=0.00570, 5000=0.00530, 10000=0.00490, 50000=0.00440 (EUR); Mount: Surface Mount; Case/Package: 0402; Case Code (Metric): 1005; Case Code (Imperial): 0402; Weight: 2.8E-05oz; Contact Plating: Tin; Min Operating Temperature: -55°C; Max Operating Temperature: 155°C; Tolerance: 1%; Packaging: Tape and Reel; Package Quantity: 1; Resistor Type: Thick Film; Number of Terminations: 2; Termination: SMD/SMT; Max Power Dissipation: 100mW; Voltage Rating (DC): 50V; Working Voltage: 50V; Features: Automotive AEC-Q200; Series: ERJ; Resistance Tolerance: 1%; Technology: THICK FILM; Construction: Rectangular; Length: 1mm; Width: 0.02inch; Height: 0.016inch; Depth: 0.5mm; Radiation Hardening: No; REACH SVHC: No SVHC; Military Standard: Not; Lead Free: Lead Free; RoHS Compliant: Yes; ComponentLink1URL: https://datasheet.ciiva.com/16773/70260748-16773110.pdf?src-supplier=Allied+Electronics; ComponentLink1Description: https://datasheet.ciiva.com/16773/70260748-16773110.pdf?src-supplier=Allied+Electronics; ComponentLink2URL: https://datasheet.ciiva.com/22749/1678782-22749654.pdf?src-supplier=Element14; ComponentLink2Description: https://datasheet.ciiva.com/22749/1678782-22749654.pdf?src-supplier=Element14; ComponentLink3URL: https://datasheet.ciiva.com/24158/aoa0000ce2-24158871.pdf?src-supplier=Mouser; ComponentLink3Description: https://datasheet.ciiva.com/24158/aoa0000ce2-24158871.pdf?src-supplier=Mouser; ComponentLink4URL: https://datasheet.ciiva.com/46388/426256-46388311.pdf?src-supplier=Element14; ComponentLink4Description: https://datasheet.ciiva.com/46388/426256-46388311.pdf?src-supplier=Element14; ComponentLink5URL: https://datasheet.ciiva.com/16199/aoa0000ce2-16199546.pdf?src-supplier=Future+Electronics; ComponentLink5Description: https://datasheet.ciiva.com/16199/aoa0000ce2-16199546.pdf?src-supplier=Future+Electronics; ComponentLink6URL: https://datasheet.ciiva.com/16775/70260748-16775018.pdf?src-supplier=Allied+Electronics; ComponentLink6Description: https://datasheet.ciiva.com/16775/70260748-16775018.pdf?src-supplier=Allied+Electronics; ComponentLink7URL: https://datasheet.ciiva.com/46376/426256-46376955.pdf?src-supplier=Element14; ComponentLink7Description: https://datasheet.ciiva.com/46376/426256-46376955.pdf?src-supplier=Element14; ComponentLink8URL: https://datasheet.ciiva.com/48530/aoa0000ce2-48530971.pdf?src-supplier=Avnet; ComponentLink8Description: https://datasheet.ciiva.com/48530/aoa0000ce2-48530971.pdf?src-supplier=Avnet; Supplier Part Number 1: 2059145
U?#1 = STM32F303R8T6: No Description Available; Vendor: STMicroelectronics; Built_By: EMA_UL_Team; SourceLibrary: Updates_to_database_2020-10-19; Manufacturer_Part_Number: STM32F303R8T6; Copyright: Copyright (C) 2018 Accelerated Designs. All rights reserved; RefDes: RefDes; Type: DEV